# Altium project GameBoard_V1I1.PrjPcb (part 14 of 20)

## Sheet [16] - HDMI.SchDoc
size A3; DocumentNumber: 16; SheetNumber: 16; SheetTotal: 32
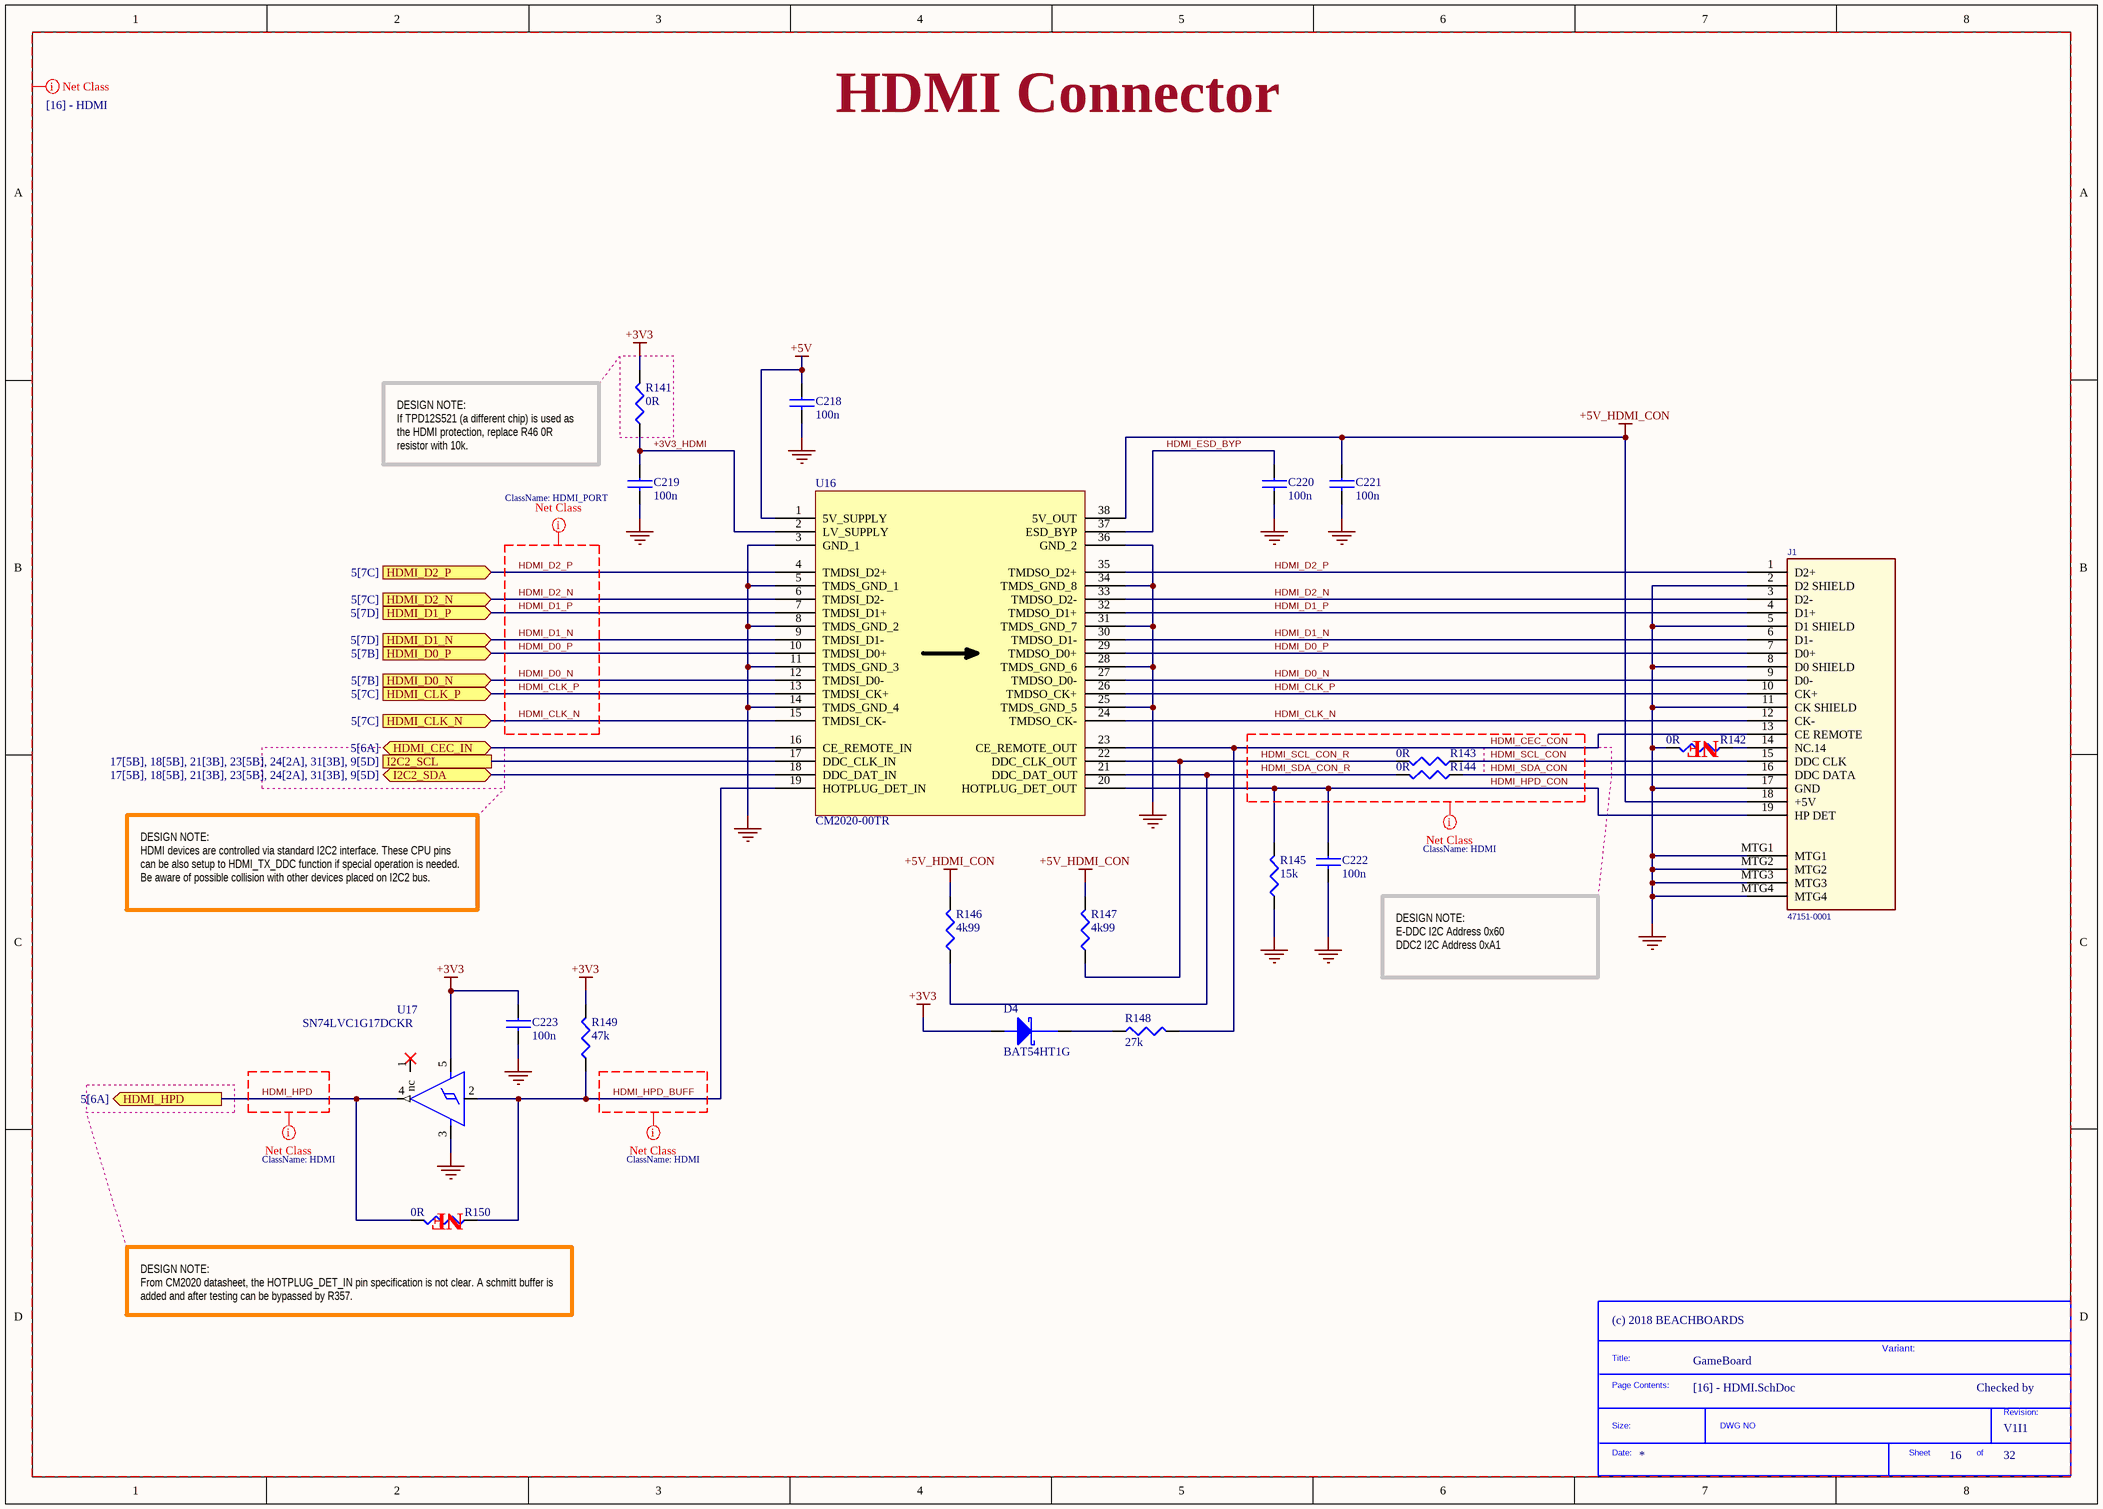
[diagram p76: [16] - HDMI.SchDoc]

### Parts
(Parts that share a designator on the sheet are numbered #1, #2 ... from top to bottom, then left to right.)
*#25  SDTitleBlock  (value not drawn)  (graphical)
C218  100n  [C0402]
C219  100n  [C0402]
C220  100n  [C0402]
C221  100n  [C0402]
C222  100n  [C0402]
C223  100n  [C0402]
D4  BAT54HT1G  [SOD323]
J1  47151-0001  [HDMI V1.1]
R141  0R  [R0402]
R142  0R  [R0402]
R143  0R  [R0402]
R144  0R  [R0402]
R145  15k  [R0402]
R146  4k99  [R0402]
R147  4k99  [R0402]
R148  27k  [R0402]
R149  47k  [R0402]
R150  0R  [R0402]
U16  CM2020-00TR  [TSSOP_38]
U17  SN74LVC1G17DCKR  [SC70_5]

### Ports
HDMI_CEC_IN (bidir, see 5[6A]), HDMI_CLK_N (in, see 5[7C]), HDMI_CLK_P (in, see 5[7C]), HDMI_D0_N (in, see 5[7B]), HDMI_D0_P (in, see 5[7B]), HDMI_D1_N (in, see 5[7D]), HDMI_D1_P (in, see 5[7D]), HDMI_D2_N (in, see 5[7C]), HDMI_D2_P (in, see 5[7C]), HDMI_HPD (out, see 5[6A]), I2C2_SCL (see 17[5B], 18[5B], 21[3B], 23[5B], 24[2A], 31[3B], 9[5D]), I2C2_SDA (bidir, see 17[5B], 18[5B], 21[3B], 23[5B], 24[2A], 31[3B], 9[5D])

### Nets
+3V3: C223.1 D4.2(Anode) R141.2 R149.2 U17.5(NC1)
+5V: C218.1 U16.1(5V_SUPPLY)
+5V_HDMI_CON: C221.1 J1.18(+5V) R146.2 R147.2 U16.38(5V_OUT)
GND: C218.2 C219.2 C220.2 C221.2 C222.2 C223.2 J1.2(D2_SHIELD) J1.5(D1_SHIELD) J1.8(D0_SHIELD) J1.11(CK_SHIELD) J1.17(GND) J1.MTG1 J1.MTG2 J1.MTG3 J1.MTG4 R142.2 R145.1 U16.3(GND_1) U16.5(TMDS_GND_1) U16.8(TMDS_GND_2) U16.11(TMDS_GND_3) U16.14(TMDS_GND_4) U16.25(TMDS_GND_5) U16.28(TMDS_GND_6) U16.31(TMDS_GND_7) U16.34(TMDS_GND_8) U16.36(GND_2) U17.3(GND)
+3V3_HDMI: C219.1 R141.1 U16.2(LV_SUPPLY)
HDMI_CEC_CON: J1.13(CE_REMOTE) R148.2 U16.23(CE_REMOTE_OUT)
HDMI_CEC_IN: U16.16(CE_REMOTE_IN) ; port HDMI_CEC_IN
HDMI_CLK_N: J1.12(CK-) U16.15(TMDSI_CK-) U16.24(TMDSO_CK-) ; port HDMI_CLK_N
HDMI_CLK_P: J1.10(CK+) U16.13(TMDSI_CK+) U16.26(TMDSO_CK+) ; port HDMI_CLK_P
HDMI_D0_N: J1.9(D0-) U16.12(TMDSI_D0-) U16.27(TMDSO_D0-) ; port HDMI_D0_N
HDMI_D0_P: J1.7(D0+) U16.10(TMDSI_D0+) U16.29(TMDSO_D0+) ; port HDMI_D0_P
HDMI_D1_N: J1.6(D1-) U16.9(TMDSI_D1-) U16.30(TMDSO_D1-) ; port HDMI_D1_N
HDMI_D1_P: J1.4(D1+) U16.7(TMDSI_D1+) U16.32(TMDSO_D1+) ; port HDMI_D1_P
HDMI_D2_N: J1.3(D2-) U16.6(TMDSI_D2-) U16.33(TMDSO_D2-) ; port HDMI_D2_N
HDMI_D2_P: J1.1(D2+) U16.4(TMDSI_D2+) U16.35(TMDSO_D2+) ; port HDMI_D2_P
HDMI_ESD_BYP: C220.1 U16.37(ESD_BYP)
HDMI_HPD: R150.2 U17.4(O) ; port HDMI_HPD
HDMI_HPD_BUFF: R149.1 R150.1 U16.19(HOTPLUG_DET_IN) U17.2(I)
HDMI_HPD_CON: C222.1 J1.19(HP_DET) R145.2 U16.20(HOTPLUG_DET_OUT)
HDMI_SCL_CON: J1.15(DDC_CLK) R143.1
HDMI_SCL_CON_R: R143.2 R147.1 U16.22(DDC_CLK_OUT)
HDMI_SDA_CON: J1.16(DDC_DATA) R144.1
HDMI_SDA_CON_R: R144.2 R146.1 U16.21(DDC_DAT_OUT)
I2C2_SCL: U16.17(DDC_CLK_IN) ; port I2C2_SCL
I2C2_SDA: U16.18(DDC_DAT_IN) ; port I2C2_SDA
NetD4_1: D4.1(Cathode) R148.1
NetJ1_14: J1.14(NC.14) R142.1

Not connected (* = marked no-connect by the designer): U17 1(nc)*

### Layout directives
net class HDMI: HDMI_CEC_CON, HDMI_HPD, HDMI_HPD_BUFF, HDMI_HPD_CON, HDMI_SCL_CON, HDMI_SCL_CON_R, HDMI_SDA_CON, HDMI_SDA_CON_R
net class [16] - HDMI: +3V3, +3V3_HDMI, +5V, +5V_HDMI_CON, GND, HDMI_CEC_CON, HDMI_CLK_N, HDMI_CLK_P, HDMI_D0_N, HDMI_D0_P, HDMI_D1_N, HDMI_D1_P, HDMI_D2_N, HDMI_D2_P, HDMI_ESD_BYP, HDMI_HPD, HDMI_HPD_BUFF, HDMI_HPD_CON, HDMI_SCL_CON, HDMI_SCL_CON_R, HDMI_SDA_CON, HDMI_SDA_CON_R
net class HDMI_PORT: HDMI_CLK_N, HDMI_CLK_P, HDMI_D0_N, HDMI_D0_P, HDMI_D1_N, HDMI_D1_P, HDMI_D2_N, HDMI_D2_P

### Notes on the sheet
- HDMI Connector
- DESIGN NOTE:
  If TPD12S521 (a different chip) is used as the HDMI protection, replace R46 0R resistor with 10k.
- DESIGN NOTE:
  HDMI devices are controlled via standard I2C2 interface. These CPU pins can be also setup to HDMI_TX_DDC function if special operation is needed. Be aware of possible collision with other devices placed on I2C2 bus.
- DESIGN NOTE:
  E-DDC I2C Address 0x60
  DDC2 I2C Address 0xA1
- (near R150) DESIGN NOTE:
  From CM2020 datasheet, the HOTPLUG_DET_IN pin specification is not clear. A schmitt buffer is added and after testing can be bypassed by R357.
- Variant:
- Checked by
- (in symbol SDTitleBlock) Title:; Page Contents:; Revision:; Size:; DWG NO; Date:; Sheet; of

### Library data of the parts
C218-C223 = C1005X5R1H104K: CAP CER .10UF 50V X5R 10% 0402; Manufacturer: TDK Corporation; Capacitance: 0.1µF; Value: 100nF; .Checked PCB: used; Category: Capacitors; Supplier Part Number: 445-5942-1-ND; Manufacturer Part Number: C1005X5R1H104K; Operating Temperature: -55°C ~ 85°C; Package / Case: 0402 (1005 Metric); Price 1k [$]: 0.02340; .Checked SCH: used; Voltage - Rated: 50V; Supplier: Digikey; Supplier 1: Digi-Key; Supplier Part Number 1: 445-5942-1-ND; RoHS: RoHS Compliant; Stock 1: 106926; Pricing 1: 1=0.27, 10=0.18, 100=0.072, 250=0.05176, 500=0.0369, 1000=0.027 (USD); Tolerance: ±10%; Temperature Coefficient: X5R; Mounting Type: Surface Mount, MLCC; Applications: General Purpose; Ratings: -; Size / Dimension: 0.039" L x 0.020" W (1.00mm x 0.50mm); Height - Seated (Max): -; Thickness (Max): 0.022" (0.55mm); Lead Spacing: -; Features: -; Packaging: Cut Tape (CT); Lead Style: -; ComponentLink1URL: http://www.tdk.co.jp/tefe02/e412_c.pdf; ComponentLink1Description: http://www.tdk.co.jp/tefe02/e412_c.pdf; Supplier 2: Digi-Key; Supplier Part Number 2: 311-1697-6-ND
D4 = BAT54HT1G: DIODE SCHOTTKY 30V 0.2A SOD323; Manufacturer: Fairchild Semiconductor; Current - Average Rectified (Io): 200mA; Voltage - Forward (Vf) (Max) @ If: 800mV @ 100mA; Speed: Small Signal =< 200mA (Io), Any Speed; Reverse Recovery Time (trr): 5ns; Current - Reverse Leakage @ Vr: 2µA @ 25V; Capacitance @ Vr, F: 10pF @ 1V, 1MHz; Thermal Resistance: 600°C/W Ja; .Creator: MM; .Checked PCB: used; Supplier 1: Digi-Key; Manufacturer Part Number: BAT54HT1G; RoHS: RoHS Compliant; Category: Discrete Semiconductor Products; Stock 1: 11388; Pricing 1: 1=0.3, 10=0.276, 25=0.1984, 100=0.1543, 250=0.09696, 500=0.0826, 1000=0.05628 (USD); Packaging: Cut Tape (CT); Diode Type: Schottky; Voltage - DC Reverse (Vr) (Max): 30V; Mounting Type: Surface Mount; Package / Case: SC-76, SOD-323; Supplier Device Package: SOD-323; Operating Temperature - Junction: -55°C ~ 150°C; ComponentLink1URL: http://www.fairchildsemi.com/ds/BA/BAT54HT1G.pdf; ComponentLink1Description: http://www.fairchildsemi.com/ds/BA/BAT54HT1G.pdf; Supplier Part Number 1: BAT54HT1GCT-ND; .Checked SCH: used; Supplier 2: Digi-Key; Supplier Part Number 2: NSVBAT54HT1GOSCT-ND
J1 = 47151-0001_v1.1: CONN RCPT 19POS HDMI RT ANG SMD; Manufacturer: Molex Connector Corporation; .Checked PCB: used; Number of Positions: 19; Pitch: 0.50mm (.020"); Gender: Receptacle; .Version: V1.1 - Changed holes to slots; .Checked SCH: used; Category: Connectors, Interconnects; Connector Type: HDMI; Family: USB, IEEE-1394 (Firewire), DVI, HDMI; Manufacturer Part Number: 47151-0001; Operating Temperature: -20°C to +85°C; Price 1k [$]: 1.74610; Supplier: Digikey; Supplier Part Number: WM19086CT-ND; Value: 47151-0001; Supplier 1: Digi-Key; Supplier Part Number 1: WM19086CT-ND; RoHS: RoHS Compliant; Stock 1: 2756; Pricing 1: 1=3.1, 10=2.57, 50=2.1456, 100=1.9034 (USD); Number of Contacts: 19; Specifications: -; Mounting Type: Surface Mount, Right Angle, Horizontal; Features: Detent Lock; Packaging: Cut Tape (CT); Ingress Protection: -; ComponentLink1URL: http://www.molex.com/pdm_docs/sd/471510001_sd.pdf; ComponentLink1Description: http://www.molex.com/pdm_docs/sd/471510001_sd.pdf
R141-R144 R150 = RC0402JR-070RL: RES 0.0 OHM 1/16W 0402 SMD; Manufacturer: Yageo; Resistance (Ohms): 0.0; Power (Watts): 0.063W, 1/16W; Tolerance: Jumper; .Checked PCB: used; Category: Resistors; Manufacturer Part Number: RC0402JR-070RL; Package / Case: 0402 (1005 Metric); Price 1k [$]: 0.01389; Value: 0R; .Checked SCH: used; Supplier Part Number: 311-0.0JRCT-ND; Supplier: Digikey; Supplier 1: Digi-Key; Supplier Part Number 1: 311-0.0JRCT-ND; RoHS: RoHS Compliant; Stock 1: 1106330; Pricing 1: 10=0.012, 50=0.009, 100=0.0069, 250=0.00512, 500=0.0038, 1000=0.00253 (USD); Composition: Thick Film; Features: -; Temperature Coefficient: -; Size / Dimension: 0.039" L x 0.020" W (1.00mm x 0.50mm); Height: 0.016" (0.40mm); Number of Terminations: 2; Packaging: Cut Tape (CT); ComponentLink1URL: http://www.yageo.com/documents/recent/PYu-RC0402_51_RoHS_L_6.pdf; ComponentLink1Description: http://www.yageo.com/documents/recent/PYu-RC0402_51_RoHS_L_6.pdf
R145 = RC0402FR-0715KL: RES 15.0K OHM 1/16W 1% 0402 SMD; Manufacturer: Yageo; Power (Watts): 0.063W, 1/16W; .Checked PCB: used; Temperature Coefficient: ±100ppm/°C; Category: Resistors; Supplier Part Number: 311-15.0KLRCT-ND; Manufacturer Part Number: RC0402FR-0715KL; Package / Case: 0402 (1005 Metric); Price 1k [$]: 0.01421; Resistance (Ohms): 15K; Tolerance: ±1%; Value: 15k; .Checked SCH: used; Supplier: Digikey; Supplier 1: Digi-Key; Supplier Part Number 1: 311-15.0KLRCT-ND; RoHS: RoHS Compliant; Stock 1: 31992; Pricing 1: 10=0.014, 50=0.0104, 100=0.0079, 250=0.00584, 500=0.00432, 1000=0.00288 (USD); Composition: Thick Film; Features: -; Size / Dimension: 0.039" L x 0.020" W (1.00mm x 0.50mm); Height: 0.016" (0.40mm); Number of Terminations: 2; Packaging: Cut Tape (CT); ComponentLink1URL: http://www.yageo.com/documents/recent/PYu-RC0402_51_RoHS_L_6.pdf; ComponentLink1Description: http://www.yageo.com/documents/recent/PYu-RC0402_51_RoHS_L_6.pdf
R146 R147 = RMCF0402FT4K99: RES TF 4.99K OHM 1% 1/16W 0402; Manufacturer: Stackpole Electronics Inc; Power (Watts): 0.063W, 1/16W; .Checked PCB: used; Temperature Coefficient: ±100ppm/°C; Category: Resistors; Supplier Part Number: RMCF0402FT4K99CT-ND; Manufacturer Part Number: RMCF0402FT4K99; Package / Case: 0402 (1005 Metric); Price 1k [$]: 0.00384; Resistance (Ohms): 4.99K; Tolerance: ±1%; Value: 4k99; .Checked SCH: used; Supplier: Digikey; Supplier 1: Digi-Key; Supplier Part Number 1: RMCF0402FT4K99CT-ND; RoHS: RoHS Compliant; Stock 1: 48509; Pricing 1: 1=0.04, 10=0.025, 50=0.0138, 100=0.0105, 250=0.0078, 500=0.00576, 1000=0.00384 (USD); Composition: Thick Film; Features: -; Size / Dimension: 0.039" L x 0.020" W (1.00mm x 0.50mm); Height: 0.016" (0.40mm); Number of Terminations: 2; Packaging: Cut Tape (CT); ComponentLink1URL: http://www.seielect.com/Catalog/SEI-RMCF.pdf; ComponentLink1Description: http://www.seielect.com/Catalog/SEI-RMCF.pdf
R148 = RC0402FR-0727KL: RES 27.0K OHM 1/16W 1% 0402 SMD; Manufacturer: Yageo; Power (Watts): 0.063W, 1/16W; .Checked PCB: used; Temperature Coefficient: ±100ppm/°C; Category: Resistors; Supplier Part Number: 311-27.0KLRCT-ND; Manufacturer Part Number: RC0402FR-0727KL; Package / Case: 0402 (1005 Metric); Price 1k [$]: 0.00288; Resistance (Ohms): 27K; Tolerance: ±1%; Value: 27k; .Checked SCH: used; Supplier: Digikey; Supplier 1: Digi-Key; Supplier Part Number 1: 311-27.0KLRCT-ND; RoHS: RoHS Compliant; Stock 1: 21638; Pricing 1: 10=0.014, 50=0.0104, 100=0.0079, 250=0.00584, 500=0.00432, 1000=0.00288 (USD); Composition: Thick Film; Features: -; Size / Dimension: 0.039" L x 0.020" W (1.00mm x 0.50mm); Height: 0.016" (0.40mm); Number of Terminations: 2; Packaging: Cut Tape (CT); ComponentLink1URL: http://www.yageo.com/documents/recent/PYu-RC0402_51_RoHS_L_6.pdf; ComponentLink1Description: http://www.yageo.com/documents/recent/PYu-RC0402_51_RoHS_L_6.pdf
R149 = RC0402FR-0747KL: RES 47.0K OHM 1/16W 1% 0402 SMD; Manufacturer: Yageo; Power (Watts): 0.063W, 1/16W; .Checked PCB: used; Temperature Coefficient: ±100ppm/°C; Category: Resistors; Supplier Part Number: 311-47.0KLRCT-ND; Manufacturer Part Number: RC0402FR-0747KL; Package / Case: 0402 (1005 Metric); Price 1k [$]: 0.01421; Resistance (Ohms): 47K; Tolerance: ±1%; Value: 47k; .Checked SCH: used; Supplier: Digikey; Supplier 1: Digi-Key; Supplier Part Number 1: 311-47.0KLRCT-ND; RoHS: RoHS Compliant; Stock 1: 1227580; Pricing 1: 10=0.014, 50=0.0104, 100=0.0079, 250=0.00584, 500=0.00432, 1000=0.00288 (USD); Composition: Thick Film; Features: -; Size / Dimension: 0.039" L x 0.020" W (1.00mm x 0.50mm); Height: 0.016" (0.40mm); Number of Terminations: 2; Packaging: Cut Tape (CT); ComponentLink1URL: http://www.yageo.com/documents/recent/PYu-RC0402_51_RoHS_L_6.pdf; ComponentLink1Description: http://www.yageo.com/documents/recent/PYu-RC0402_51_RoHS_L_6.pdf; Supplier 2: Digi-Key; Supplier Part Number 2: 1276-3467-1-ND
U16 = CM2020-00TR: IC HDMI TX PORT P/I 38-TSSOP; Manufacturer: ON Semiconductor; .Creator: MM; .Checked PCB: used; Supplier 1: Digi-Key; Manufacturer Part Number: CM2020-00TR; RoHS: RoHS Compliant; Category: Integrated Circuits (ICs); Stock 1: 7580; Pricing 1: 1=1.52, 10=1.34, 25=1.2096, 100=1.0584, 250=0.9282, 500=0.8232, 1000=0.651 (USD); Packaging: Cut Tape (CT); Type: HDMI Transmitter; Applications: Consumer Electronics, DVD-RW Players, Set Top Box; Mounting Type: Surface Mount; Package / Case: 38-TFSOP (0.173", 4.40mm Width) Exposed Pad; Supplier Device Package: 38-TSSOP; ComponentLink1URL: http://www.onsemi.com/pub_link/Collateral/CM2020-00TR-D.PDF; ComponentLink1Description: http://www.onsemi.com/pub_link/Collateral/CM2020-00TR-D.PDF; Supplier Part Number 1: CM2020-00TROSCT-ND; .Checked SCH: used
U17 = SN74LVC1G17DCKR: IC BUFFER SCHMIT TRIG SC705; Manufacturer: Texas Instruments; Logic Type: Schmitt Trigger - Buffer, Driver; Number of Elements: 1; Current - Output High, Low: 32mA, 32mA; Voltage - Supply: 1.65 V ~ 5.5 V; .Checked PCB: used; Supplier 1: Digi-Key; Supplier Part Number 1: 296-11934-1-ND; Manufacturer Part Number: SN74LVC1G17DCKR; RoHS: RoHS Compliant; Category: Integrated Circuits (ICs); Stock 1: 50549; Pricing 1: 1=0.12, 10=0.097, 25=0.086, 100=0.0581, 250=0.05696, 500=0.0559, 750=0.05483 (USD); Number of Bits per Element: 1; Operating Temperature: -40°C ~ 85°C; Mounting Type: Surface Mount; Package / Case: 6-TSSOP (5 Lead), SC-88A, SOT-353; Supplier Device Package: SC-70-5; Packaging: Cut Tape (CT); ComponentLink1URL: http://www.ti.com/lit/ds/symlink/sn74lvc1g17.pdf; ComponentLink1Description: http://www.ti.com/lit/ds/symlink/sn74lvc1g17.pdf; .Checked SCH: used

## Sheet [21] - AUDIO.SchDoc
size A3; DocumentNumber: 21; SheetNumber: 21; SheetTotal: 32
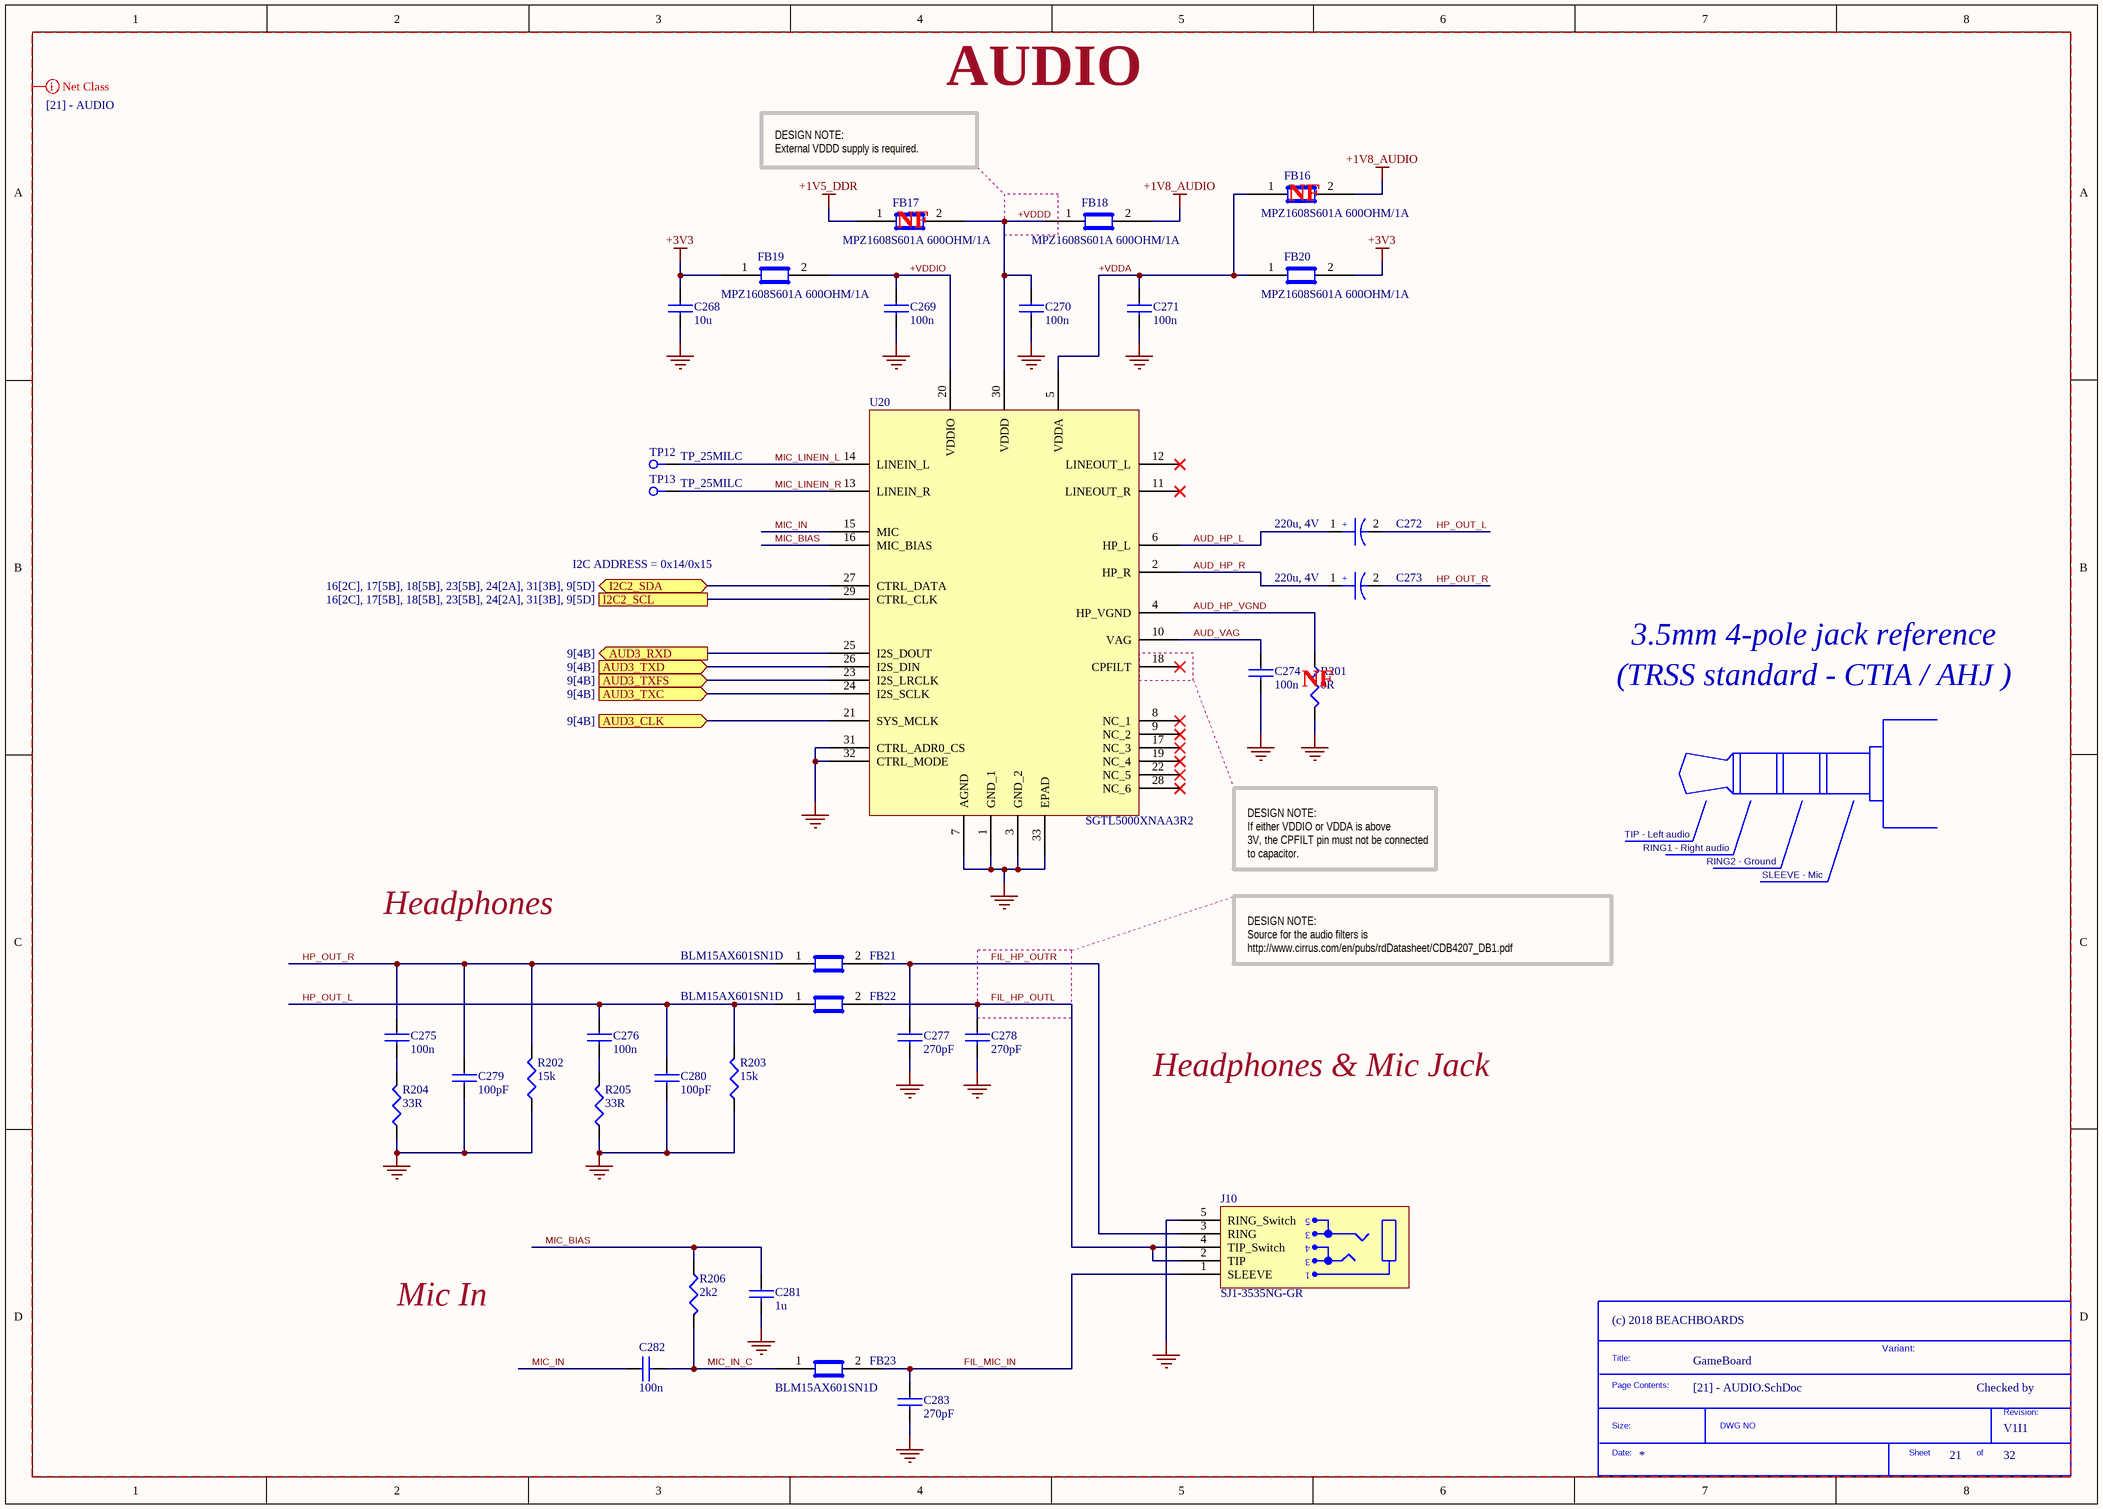
[diagram p77: [21] - AUDIO.SchDoc]

### Parts
(Parts that share a designator on the sheet are numbered #1, #2 ... from top to bottom, then left to right.)
*#26  SDTitleBlock  (value not drawn)  (graphical)
C268  10u  [C0603]
C269  100n  [C0402]
C270  100n  [C0402]
C271  100n  [C0402]
C272  220u, 4V  [C1206 -  TLN S Case Tantal]
C273  220u, 4V  [C1206 -  TLN S Case Tantal]
C274  100n  [C0402]
C275  100n  [C0402]
C276  100n  [C0402]
C277  270pF  [C0402]
C278  270pF  [C0402]
C279  100pF  [C0402]
C280  100pF  [C0402]
C281  1u  [C0402]
C282  100n  [C0402]
C283  270pF  [C0402]
FB16  MPZ1608S601A 600OHM/1A  [C0603]
FB17  MPZ1608S601A 600OHM/1A  [C0603]
FB18  MPZ1608S601A 600OHM/1A  [C0603]
FB19  MPZ1608S601A 600OHM/1A  [C0603]
FB20  MPZ1608S601A 600OHM/1A  [C0603]
FB21  BLM15AX601SN1D  [C0402]
FB22  BLM15AX601SN1D  [C0402]
FB23  BLM15AX601SN1D  [C0402]
J10  SJ1-3535NG-GR  [SJ1-3535NG]
R201  0R  [R0402]
R202  15k  [R0402]
R203  15k  [R0402]
R204  33R  [R0402]
R205  33R  [R0402]
R206  2k2  [R0402]
TP12  TP_25MILC  [TP_25C]  (no BOM)
TP13  TP_25MILC  [TP_25C]  (no BOM)
U20  SGTL5000XNAA3R2  [QFN32 5x5x0.85_V1.1]

### Ports
AUD3_CLK (in, see 9[4B]), AUD3_RXD (out, see 9[4B]), AUD3_TXC (in, see 9[4B]), AUD3_TXD (in, see 9[4B]), AUD3_TXFS (in, see 9[4B]), I2C2_SCL (see 16[2C], 17[5B], 18[5B], 23[5B], 24[2A], 31[3B], 9[5D]), I2C2_SDA (bidir, see 16[2C], 17[5B], 18[5B], 23[5B], 24[2A], 31[3B], 9[5D])

### Nets
+1V5_DDR: FB17.1
+1V8_AUDIO: FB16.2 FB18.2
+3V3: C268.1 FB19.1 FB20.2
GND: C268.2 C269.2 C270.2 C271.2 C274.2 C277.2 C278.2 C279.2 C280.2 C281.2 C283.2 J10.5(RING_Switch) R201.2 R202.1 R203.1 R204.1 R205.1 U20.1(GND_1) U20.3(GND_2) U20.7(AGND) U20.31(CTRL_ADR0_CS) U20.32(CTRL_MODE) U20.33(EPAD)
+VDDA: C271.1 FB16.1 FB20.1 U20.5(VDDA)
+VDDD: C270.1 FB17.2 FB18.1 U20.30(VDDD)
+VDDIO: C269.1 FB19.2 U20.20(VDDIO)
AUD3_CLK: U20.21(SYS_MCLK) ; port AUD3_CLK
AUD3_RXD: U20.25(I2S_DOUT) ; port AUD3_RXD
AUD3_TXC: U20.24(I2S_SCLK) ; port AUD3_TXC
AUD3_TXD: U20.26(I2S_DIN) ; port AUD3_TXD
AUD3_TXFS: U20.23(I2S_LRCLK) ; port AUD3_TXFS
AUD_HP_L: C272.1 U20.6(HP_L)
AUD_HP_R: C273.1 U20.2(HP_R)
AUD_HP_VGND: R201.1 U20.4(HP_VGND)
AUD_VAG: C274.1 U20.10(VAG)
FIL_HP_OUTL: C278.1 FB22.2 J10.2(TIP) J10.4(TIP_Switch)
FIL_HP_OUTR: C277.1 FB21.2 J10.3(RING)
FIL_MIC_IN: C283.1 FB23.2 J10.1(SLEEVE)
HP_OUT_L: C272.2 C276.1 C280.1 FB22.1 R203.2
HP_OUT_R: C273.2 C275.1 C279.1 FB21.1 R202.2
I2C2_SCL: U20.29(CTRL_CLK) ; port I2C2_SCL
I2C2_SDA: U20.27(CTRL_DATA) ; port I2C2_SDA
MIC_BIAS: C281.1 R206.1 U20.16(MIC_BIAS)
MIC_IN: C282.1 U20.15(MIC)
MIC_IN_C: C282.2 FB23.1 R206.2
MIC_LINEIN_L: TP12.1 U20.14(LINEIN_L)
MIC_LINEIN_R: TP13.1 U20.13(LINEIN_R)
NetC275_2: C275.2 R204.2
NetC276_2: C276.2 R205.2

Not connected (* = marked no-connect by the designer): U20 8(NC_1)* 9(NC_2)* 11(LINEOUT_R)* 12(LINEOUT_L)* 17(NC_3)* 18(CPFILT)* 19(NC_4)* 22(NC_5)* 28(NC_6)*

### Layout directives
net class [21] - AUDIO: +1V5_DDR, +1V8_AUDIO, +3V3, +VDDA, +VDDD, +VDDIO, AUD_HP_L, AUD_HP_R, AUD_HP_VGND, AUD_VAG, FIL_HP_OUTL, FIL_HP_OUTR, FIL_MIC_IN, GND, HP_OUT_L, HP_OUT_R, MIC_BIAS, MIC_IN, MIC_IN_C, MIC_LINEIN_L, MIC_LINEIN_R

### Notes on the sheet
- AUDIO
- DESIGN NOTE:
  External VDDD supply is required.
- I2C ADDRESS = 0x14/0x15
- 3.5mm 4-pole jack reference
- (TRSS standard - CTIA / AHJ )
- TIP - Left audio
- RING1 - Right audio
- RING2 - Ground
- Headphones
- DESIGN NOTE:
  If either VDDIO or VDDA is above
  3V, the CPFILT pin must not be connected to capacitor.
- SLEEVE - Mic
- DESIGN NOTE:
  Source for the audio filters is http://www.cirrus.com/en/pubs/rdDatasheet/CDB4207_DB1.pdf
- Headphones & Mic Jack
- Mic In
- Variant:
- Checked by
- (in symbol SDTitleBlock) Title:; Page Contents:; Revision:; Size:; DWG NO; Date:; Sheet; of
- (in symbol TLNS227M004R3000) +

### Library data of the parts
C268 = C1608X5R0J106M: CAP CER 10UF 6.3V X5R 20% 0603; Manufacturer: TDK Corporation; Capacitance: 10µF; Value: 10µF; .Checked PCB: used; Category: Capacitors; Supplier Part Number: 445-4112-1-ND; Manufacturer Part Number: C1608X5R0J106M; Operating Temperature: -55°C ~ 85°C; Package / Case: 0603 (1608 Metric); Price 1k [$]: 0.08580; .Checked SCH: used; Voltage - Rated: 6.3V; Features: Low ESR; Supplier: Digikey; Supplier 1: Digi-Key; Supplier Part Number 1: 445-4112-1-ND; RoHS: RoHS Compliant; Stock 1: 48157; Pricing 1: 1=0.46, 10=0.363, 100=0.1898, 250=0.14024, 500=0.1089, 1000=0.0858 (USD); Tolerance: ±20%; Temperature Coefficient: X5R; Mounting Type: Surface Mount, MLCC; Applications: General Purpose; Ratings: -; Size / Dimension: 0.063" L x 0.031" W (1.60mm x 0.80mm); Height - Seated (Max): -; Thickness (Max): 0.037" (0.95mm); Lead Spacing: -; Packaging: Cut Tape (CT); Lead Style: -; ComponentLink1URL: http://www.tdk.com/pdf/general_B11.pdf; ComponentLink1Description: http://www.tdk.com/pdf/general_B11.pdf
C269-C271 C274-C276 C282 = C1005X5R1H104K: as C218-C223 on sheet [16] - HDMI; Category: Capacitors; Supplier Part Number: 445-5942-1-ND; Manufacturer Part Number: C1005X5R1H104K; Operating Temperature: -55°C ~ 85°C; Package / Case: 0402 (1005 Metric); Price 1k [$]: 0.02340; .Checked SCH: used; Voltage - Rated: 50V; Supplier: Digikey; Supplier 1: Digi-Key; Supplier Part Number 1: 445-5942-1-ND; RoHS: RoHS Compliant; Stock 1: 106926; Pricing 1: 1=0.27, 10=0.18, 100=0.072, 250=0.05176, 500=0.0369, 1000=0.027 (USD); Tolerance: ±10%; Temperature Coefficient: X5R; Mounting Type: Surface Mount, MLCC; Applications: General Purpose; Ratings: -; Size / Dimension: 0.039" L x 0.020" W (1.00mm x 0.50mm); Height - Seated (Max): -; Thickness (Max): 0.022" (0.55mm); Lead Spacing: -; Features: -; Packaging: Cut Tape (CT); Lead Style: -; ComponentLink1URL: http://www.tdk.co.jp/tefe02/e412_c.pdf; ComponentLink1Description: http://www.tdk.co.jp/tefe02/e412_c.pdf; Supplier 2: Digi-Key; Supplier Part Number 2: 311-1697-6-ND
C272 C273 = TLNS227M004R3000: CAP TANT 220UF 4V 20% 1206; Manufacturer: AVX Corporation; Manufacturer Size Code: S; Capacitance: 220µF; ESR (Equivalent Series Resistance): 3.000 Ohm; Type: Molded; .Checked PCB: used; Supplier 1: Digi-Key; Supplier Part Number 1: 478-5526-1-ND; Manufacturer Part Number: TLNS227M004R3000; RoHS: RoHS Compliant; Category: Capacitors; Stock 1: 21393; Pricing 1: 1=1.35, 10=1.128, 100=0.72, 250=0.6, 500=0.54, 1000=0.492 (USD); Voltage - Rated: 4V; Tolerance: ±20%; Operating Temperature: -55°C ~ 125°C; Mounting Type: Surface Mount; Package / Case: 1206 (3216 Metric); Size / Dimension: 0.126" L x 0.063" W (3.20mm x 1.60mm); Height - Seated (Max): 0.047" (1.20mm); Lead Spacing: -; Features: General Purpose; Packaging: Cut Tape (CT); Lifetime @ Temp.: -; ComponentLink1URL: http://www.avx.com/docs/Catalogs/tlnunder.pdf; ComponentLink1Description: http://www.avx.com/docs/Catalogs/tlnunder.pdf; .Checked SCH: used
C277 C278 C283 = GRM155R71H271KA01D: CAP CER 270PF 50V 10% X7R 0402; Manufacturer: Murata Electronics North America; .Checked PCB: used; Supplier 1: Digi-Key; Supplier Part Number 1: 490-1299-1-ND; Manufacturer Part Number: GRM155R71H271KA01D; RoHS: RoHS Compliant; Category: Capacitors; Stock 1: 83894; Pricing 1: 10=0.032, 50=0.0252, 100=0.0189, 250=0.01364, 500=0.01008, 1000=0.00683, 5000=0.00525 (USD); Capacitance: 270pF; Voltage - Rated: 50V; Tolerance: ±10%; Temperature Coefficient: X7R; Mounting Type: Surface Mount, MLCC; Operating Temperature: -55°C ~ 125°C; Applications: General Purpose; Ratings: -; Package / Case: 0402 (1005 Metric); Size / Dimension: 0.039" L x 0.020" W (1.00mm x 0.50mm); Height - Seated (Max): -; Thickness (Max): 0.022" (0.55mm); Lead Spacing: -; Features: -; Packaging: Cut Tape (CT); Lead Style: -; ComponentLink1URL: http://search.murata.co.jp/Ceramy/image/img/PDF/ENG/GRM155R71H271KA01.pdf; ComponentLink1Description: http://search.murata.co.jp/Ceramy/image/img/PDF/ENG/GRM155R71H271KA01.pdf; .Checked SCH: used; Supplier 2: Digi-Key; Supplier Part Number 2: 399-7784-1-ND
C279 C280 = C1005C0G1H101J: CAP CER 100PF 50V 5% NP0 0402; Manufacturer: TDK Corporation; Temperature Coefficient: C0G, NP0; .Checked PCB: used; Supplier 1: Digi-Key; Supplier Part Number 1: 490-7311-1-ND; Manufacturer Part Number: C1005C0G1H101J; RoHS: RoHS Compliant; Category: Capacitors; Capacitance: 100pF; Voltage - Rated: 50V; Tolerance: ±5%; Mounting Type: Surface Mount, MLCC; Operating Temperature: -55°C ~ 125°C; Applications: General Purpose; Ratings: -; Package / Case: 0402 (1005 Metric); Size / Dimension: 0.039" L x 0.020" W (1.00mm x 0.50mm); Height - Seated (Max): -; Thickness (Max): 0.022" (0.55mm); Lead Spacing: -; Features: -; Packaging: Cut Tape (CT); Lead Style: -; ComponentLink1URL: http://www.tdk.com/pdf/general_B11.pdf; ComponentLink1Description: http://www.tdk.com/pdf/general_B11.pdf; .Checked SCH: used; Supplier 2: Digi-Key; Supplier Part Number 2: 399-15922-1-ND
C281 = C1005X5R1C105K: CAP CER 1.0UF 16V X5R 0402; Manufacturer: TDK Corporation; Capacitance: 1.0µF; Value: 1uF; .Checked PCB: used; Tolerance: ±10%; Category: Capacitors; Supplier Part Number: 445-4978-1-ND; Manufacturer Part Number: C1005X5R1C105K; Operating Temperature: -55°C ~ 85°C; Package / Case: 0402 (1005 Metric); Price 1k [$]: 0.02080; .Checked SCH: used; Voltage - Rated: 16V; Supplier: Digikey; Supplier 1: Digi-Key; Supplier Part Number 1: 445-4978-1-ND; RoHS: RoHS Compliant; Stock 1: 341010; Pricing 1: 1=0.24, 10=0.16, 100=0.064, 250=0.046, 500=0.0328, 1000=0.024 (USD); Temperature Coefficient: X5R; Mounting Type: Surface Mount, MLCC; Applications: General Purpose; Ratings: -; Size / Dimension: 0.039" L x 0.020" W (1.00mm x 0.50mm); Height - Seated (Max): -; Thickness (Max): 0.022" (0.55mm); Lead Spacing: -; Features: -; Packaging: Cut Tape (CT); Lead Style: -; ComponentLink1URL: http://www.tdk.co.jp/tefe02/e412_c.pdf; ComponentLink1Description: http://www.tdk.co.jp/tefe02/e412_c.pdf; Supplier 2: Digi-Key; Supplier Part Number 2: 445-13181-1-ND
FB16-FB20 = MPZ1608S601A: FERRITE CHIP BEAD 600 OHM SMD 1A; Manufacturer: TDK Corporation; Impedance @ Frequency: 600 Ohm @ 100MHz; DC Resistance (DCR): 150 mOhm Max; Filter Type: Differential Mode - Single; Number of Lines: 1; .Checked PCB: used; Supplier 1: Digi-Key; Supplier Part Number 1: 445-2205-1-ND; Manufacturer Part Number: MPZ1608S601A; RoHS: RoHS Compliant; Category: Filters; Stock 1: 328345; Pricing 1: 1=0.36, 10=0.24, 100=0.096, 250=0.069, 500=0.0492, 1000=0.036 (USD); Current Rating: 1A; Package / Case: 0603 (1608 Metric); Mounting Type: Surface Mount; Packaging: Cut Tape (CT); Height (Max): 0.037" (0.95mm); Size / Dimension: 0.063" L x 0.031" W (1.60mm x 0.80mm); ComponentLink1URL: http://www.tdk.co.jp/tefe02/e9413_mpz.pdf; ComponentLink1Description: http://www.tdk.co.jp/tefe02/e9413_mpz.pdf; .Checked SCH: used
FB21-FB23 = BLM15AX601SN1D: FERRITE CHIP 600 OHM 0402 420mA; Manufacturer: Murata Electronics North America; .Checked PCB: used; Impedance @ Frequency: 600 Ohm @ 100MHz; DC Resistance (DCR): 340 mOhm Max; Filter Type: Differential Mode - Single; Number of Lines: 1; .Checked SCH: used; Category: Filters; Manufacturer Part Number: BLM15AX601SN1D; Package / Case: 0402 (1005 Metric); Current Rating: 420mA; Supplier 1: Digi-Key; Supplier Part Number 1: 490-5441-1-ND; RoHS: RoHS Compliant; Stock 1: 34008; Pricing 1: 1=0.26, 10=0.197, 50=0.1148, 100=0.0918, 250=0.0656, 500=0.0446, 1000=0.03608, 5000=0.02821 (USD); Mounting Type: Surface Mount; Packaging: Cut Tape (CT); Height (Max): 0.022" (0.55mm); Size / Dimension: 0.039" L x 0.020" W (1.00mm x 0.50mm); ComponentLink1URL: http://search.murata.co.jp/Ceramy/image/img/PDF/ENG/L0110S0100BLM15AX_SN.pdf; ComponentLink1Description: http://search.murata.co.jp/Ceramy/image/img/PDF/ENG/L0110S0100BLM15AX_SN.pdf; Supplier Part Number: 490-5441-1-ND; Price 1k [$]: 0.03280; Value: BLM15AX601SN1D; Supplier: Digikey
J10 = SJ1-3535NG-GR: 3.50mm (0.141", 1/8", Mini Plug) - Headphone Phone Jack Stereo Connector Solder; Manufacturer: CUI; Gender: Female; Shielding: Unshielded; Current Rating: 1A; Number of Conductors: 3; Number of Ports: 1; .Creator: MB; Supplier 1: Digi-Key; Manufacturer Part Number: SJ1-3535NG-GR; Stock 1: 8769; Pricing 1: 1=1.24, 10=1.091, 25=1.0272, 50=0.9844, 100=0.9416, 250=0.856, 500=0.7704, 1000=0.6848, 2500=0.6206 (USD); Mount: Through Hole; Contact Plating: Tin; Colour: Green; Packaging: Bulk; Termination: Solder; Orientation: Horizontal; Connector Type: Jack; Lead Free: Lead Free; ComponentLink1URL: http://www.cui.com/product/resource/digikeypdf/sj1-353xng.pdf; ComponentLink1Description: http://www.cui.com/product/resource/digikeypdf/sj1-353xng.pdf; Supplier Part Number 1: CP1-3535NG-GR-ND; .Checked SCH: *; .Checked PCB: *
R201 = RC0402JR-070RL: as R141-R144 on sheet [16] - HDMI; Category: Resistors; Supplier Part Number: 311-0.0JRCT-ND; Manufacturer Part Number: RC0402JR-070RL; Package / Case: 0402 (1005 Metric); Price 1k [$]: 0.01389; Value: 0R; .Checked SCH: used; Supplier: Digikey; Supplier 1: Digi-Key; Supplier Part Number 1: 311-0.0JRCT-ND; RoHS: RoHS Compliant; Stock 1: 1106330; Pricing 1: 10=0.012, 50=0.009, 100=0.0069, 250=0.00512, 500=0.0038, 1000=0.00253 (USD); Composition: Thick Film; Features: -; Temperature Coefficient: -; Size / Dimension: 0.039" L x 0.020" W (1.00mm x 0.50mm); Height: 0.016" (0.40mm); Number of Terminations: 2; Packaging: Cut Tape (CT); ComponentLink1URL: http://www.yageo.com/documents/recent/PYu-RC0402_51_RoHS_L_6.pdf; ComponentLink1Description: http://www.yageo.com/documents/recent/PYu-RC0402_51_RoHS_L_6.pdf
R202 R203 = RC0402FR-0715KL: as R145 on sheet [16] - HDMI; Category: Resistors; Supplier Part Number: 311-15.0KLRCT-ND; Manufacturer Part Number: RC0402FR-0715KL; Package / Case: 0402 (1005 Metric); Price 1k [$]: 0.01421; Resistance (Ohms): 15K; Tolerance: ±1%; Value: 15k; .Checked SCH: used; Supplier: Digikey; Supplier 1: Digi-Key; Supplier Part Number 1: 311-15.0KLRCT-ND; RoHS: RoHS Compliant; Stock 1: 31992; Pricing 1: 10=0.014, 50=0.0104, 100=0.0079, 250=0.00584, 500=0.00432, 1000=0.00288 (USD); Composition: Thick Film; Features: -; Size / Dimension: 0.039" L x 0.020" W (1.00mm x 0.50mm); Height: 0.016" (0.40mm); Number of Terminations: 2; Packaging: Cut Tape (CT); ComponentLink1URL: http://www.yageo.com/documents/recent/PYu-RC0402_51_RoHS_L_6.pdf; ComponentLink1Description: http://www.yageo.com/documents/recent/PYu-RC0402_51_RoHS_L_6.pdf
R204 R205 = RMCF0402FT33R0: RES TF 33 OHM 1% 1/16W 0402; Manufacturer: Stackpole Electronics Inc; Resistance (Ohms): 33; Power (Watts): 0.063W, 1/16W; .Checked PCB: used; Temperature Coefficient: ±100ppm/°C; Category: Resistors; Supplier Part Number: RMCF0402FT33R0CT-ND; Manufacturer Part Number: RMCF0402FT33R0; Package / Case: 0402 (1005 Metric); Price 1k [$]: 0.00384; Tolerance: ±1%; Value: 33R; .Checked SCH: used; Supplier: Digikey; Supplier 1: Digi-Key; Supplier Part Number 1: RMCF0402FT33R0CT-ND; RoHS: RoHS Compliant; Stock 1: 26866; Pricing 1: 1=0.04, 10=0.025, 50=0.0138, 100=0.0105, 250=0.0078, 500=0.00576, 1000=0.00384 (USD); Composition: Thick Film; Features: -; Size / Dimension: 0.039" L x 0.020" W (1.00mm x 0.50mm); Height: 0.016" (0.40mm); Number of Terminations: 2; Packaging: Cut Tape (CT); ComponentLink1URL: http://www.seielect.com/Catalog/SEI-RMCF.pdf; ComponentLink1Description: http://www.seielect.com/Catalog/SEI-RMCF.pdf
R206 = RC0402FR-072K2L: RES 2.20K OHM 1/16W 1% 0402 SMD; Manufacturer: Yageo; Resistance (Ohms): 2.2K; Power (Watts): 0.063W, 1/16W; .Checked PCB: used; Temperature Coefficient: ±100ppm/°C; Category: Resistors; Supplier Part Number: 311-2.20KLRCT-ND; Manufacturer Part Number: RC0402FR-072K2L; Package / Case: 0402 (1005 Metric); Price 1k [$]: 0.01421; Tolerance: ±1%; Value: 2k2; .Checked SCH: used; Supplier: Digikey; Supplier 1: Digi-Key; Supplier Part Number 1: 311-2.20KLRCT-ND; RoHS: RoHS Compliant; Stock 1: 195154; Pricing 1: 10=0.014, 50=0.0104, 100=0.0079, 250=0.00584, 500=0.00432, 1000=0.00288 (USD); Composition: Thick Film; Features: -; Size / Dimension: 0.039" L x 0.020" W (1.00mm x 0.50mm); Height: 0.016" (0.40mm); Number of Terminations: 2; Packaging: Cut Tape (CT); ComponentLink1URL: http://www.yageo.com/documents/recent/PYu-RC0402_51_RoHS_L_6.pdf; ComponentLink1Description: http://www.yageo.com/documents/recent/PYu-RC0402_51_RoHS_L_6.pdf
TP12 TP13 = TP_25MILC: Test Point 25mil; .Checked PCB: used
U20 = SGTL5000XNAA3R2: IC AUDIO CODEC STEREO 32-QFN; Manufacturer: Freescale Semiconductor; Data Interface: I²C, Serial, SPI™; Number of ADCs / DACs: 1 / 1; Sigma Delta: No; S/N Ratio, ADCs / DACs (db) Typ: 90 / 100; Voltage - Supply, Analog: 1.62 V ~ 3.6 V; Voltage - Supply, Digital: 1.1 V ~ 2 V, 1.62 V ~ 3.6 V; .Creator: MM; .Checked PCB: used; Supplier 1: Digi-Key; Manufacturer Part Number: SGTL5000XNAA3R2; RoHS: RoHS Compliant; Category: Integrated Circuits (ICs); Stock 1: 0; Pricing 1: 1=2.66, 10=2.375, 25=2.2324, 100=2.1375, 250=2.04252, 500=1.9, 1000=1.8525 (USD); Packaging: Cut Tape (CT); Type: Stereo Audio; Resolution (Bits): -; Dynamic Range, ADCs / DACs (db) Typ: -; Operating Temperature: -40°C ~ 85°C; Mounting Type: Surface Mount; Package / Case: 32-VFQFN Exposed Pad; Supplier Device Package: 32-QFN Exposed Pad (5x5); ComponentLink1URL: http://cache.freescale.com/files/analog/doc/data_sheet/SGTL5000.pdf; ComponentLink1Description: http://cache.freescale.com/files/analog/doc/data_sheet/SGTL5000.pdf; Supplier Part Number 1: SGTL5000XNAA3R2CT-ND; .Checked SCH: used